# Altium schematic sheet HDMI.SchDoc
size A4
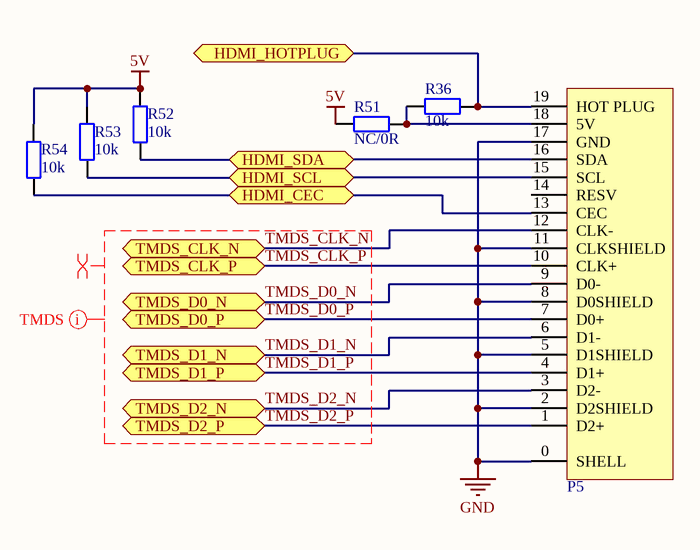
[diagram p0: HDMI.SchDoc]

## Parts
P5  HDMI  [HDMI]  (value not drawn)
R36  10k  [0402]
R51  NC/0R  [0402]
R52  10k  [0402]
R53  10k  [0402]
R54  10k  [0402]

## Ports
HDMI_CEC, HDMI_HOTPLUG, HDMI_SCL, HDMI_SDA, TMDS_CLK_N, TMDS_CLK_P, TMDS_D0_N, TMDS_D0_P, TMDS_D1_N, TMDS_D1_P, TMDS_D2_N, TMDS_D2_P

## Nets
5V: R51.1 R52.1 R53.1 R54.1
GND: P5.0(SHELL) P5.2(D2SHIELD) P5.5(D1SHIELD) P5.8(D0SHIELD) P5.11(CLKSHIELD) P5.17(GND)
HDMI_CEC: P5.13(CEC) R54.2 ; port HDMI_CEC
HDMI_HOTPLUG: P5.19(HOT_PLUG) R36.1 ; port HDMI_HOTPLUG
HDMI_SCL: P5.15(SCL) R53.2 ; port HDMI_SCL
HDMI_SDA: P5.16(SDA) R52.2 ; port HDMI_SDA
TMDS_CLK_N: P5.12(CLK-) ; port TMDS_CLK_N
TMDS_CLK_P: P5.10(CLK+) ; port TMDS_CLK_P
TMDS_D0_N: P5.9(D0-) ; port TMDS_D0_N
TMDS_D0_P: P5.7(D0+) ; port TMDS_D0_P
TMDS_D1_N: P5.6(D1-) ; port TMDS_D1_N
TMDS_D1_P: P5.4(D1+) ; port TMDS_D1_P
TMDS_D2_N: P5.3(D2-) ; port TMDS_D2_N
TMDS_D2_P: P5.1(D2+) ; port TMDS_D2_P
NetP5_18: P5.18(5V) R36.2 R51.2

Not connected (* = marked no-connect by the designer): P5 14(RESV)

## Layout directives
differential pair: TMDS_CLK_N, TMDS_CLK_P, TMDS_D0_N, TMDS_D0_P, TMDS_D1_N, TMDS_D1_P, TMDS_D2_N, TMDS_D2_P
net class TMDS: TMDS_CLK_N, TMDS_CLK_P, TMDS_D0_N, TMDS_D0_P, TMDS_D1_N, TMDS_D1_P, TMDS_D2_N, TMDS_D2_P

## Library data of the parts
R36 R51-R54 = Res2: Resistor; Value: 0Ohm; Published: 8-Jun-2000; LatestRevisionDate: 17-Jul-2002; LatestRevisionNote: Re-released for DXP Platform.; PackageReference: AXIAL-0.4; Publisher: Altium Limited; PackageDescription: Axial Device, Thru-Hole; 2 Leads; 0.4 in Pin Spacing